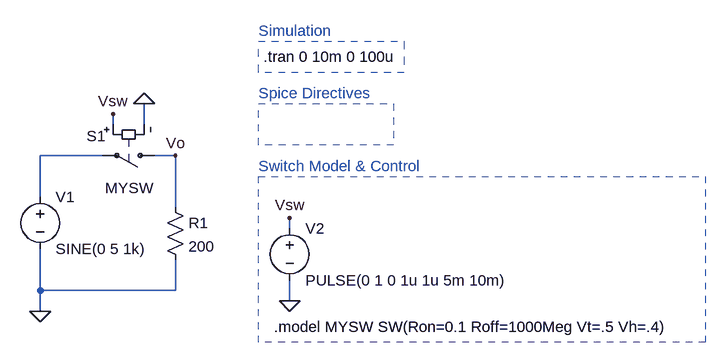
[diagram p0: schematic Simple_Switch_series.asc]
Simple_Switch_series.asc, the LTspice schematic file:
Version 4
SHEET 1 1432 696
WIRE 416 192 416 176
WIRE 464 192 464 160
WIRE 400 240 304 240
WIRE 512 240 480 240
WIRE 304 304 304 240
WIRE 512 320 512 240
WIRE 688 352 688 336
WIRE 304 448 304 384
WIRE 512 448 512 400
WIRE 512 448 304 448
WIRE 688 464 688 432
WIRE 304 480 304 448
FLAG 304 480 0
FLAG 464 160 0
FLAG 416 176 Vsw
FLAG 688 336 Vsw
FLAG 688 464 0
FLAG 512 240 Vo
SYMBOL voltage 304 288 R0
WINDOW 123 0 0 Left 0
WINDOW 39 0 0 Left 0
SYMATTR InstName V1
SYMATTR Value SINE(0 5 1k)
SYMBOL sw 496 240 R90
WINDOW 0 -30 91 VRight 2
WINDOW 3 50 18 VRight 2
SYMATTR InstName S1
SYMATTR Value MYSW
SYMBOL voltage 688 336 R0
WINDOW 123 0 0 Left 0
WINDOW 39 0 0 Left 0
SYMATTR InstName V2
SYMATTR Value PULSE(0 1 0 1u 1u 5m 10m)
SYMBOL res 496 304 R0
SYMATTR InstName R1
SYMATTR Value 200
TEXT 640 48 Left 2 ;Simulation
TEXT 648 88 Left 2 !.tran 0 10m 0 100u
TEXT 640 144 Left 2 ;Spice Directives
TEXT 664 504 Left 2 !.model MYSW SW(Ron=0.1 Roff=1000Meg Vt=.5 Vh=.4)
TEXT 640 256 Left 2 ;Switch Model & Control
RECTANGLE Normal 848 224 640 160 2
RECTANGLE Normal 1328 528 640 272 2
RECTANGLE Normal 864 112 640 64 2

The netlist it stands for:
* Simple_Switch_series.asc
V1 N001 0 SINE(0 5 1k)
S1 Vo N001 Vsw 0 MYSW
V2 Vsw 0 PULSE(0 1 0 1u 1u 5m 10m)
R1 Vo 0 200
* Simulation
.tran 0 10m 0 100u
* Spice Directives
.model MYSW SW(Ron=0.1 Roff=1000Meg Vt=.5 Vh=.4)
* Switch Model & Control
.backanno
.end